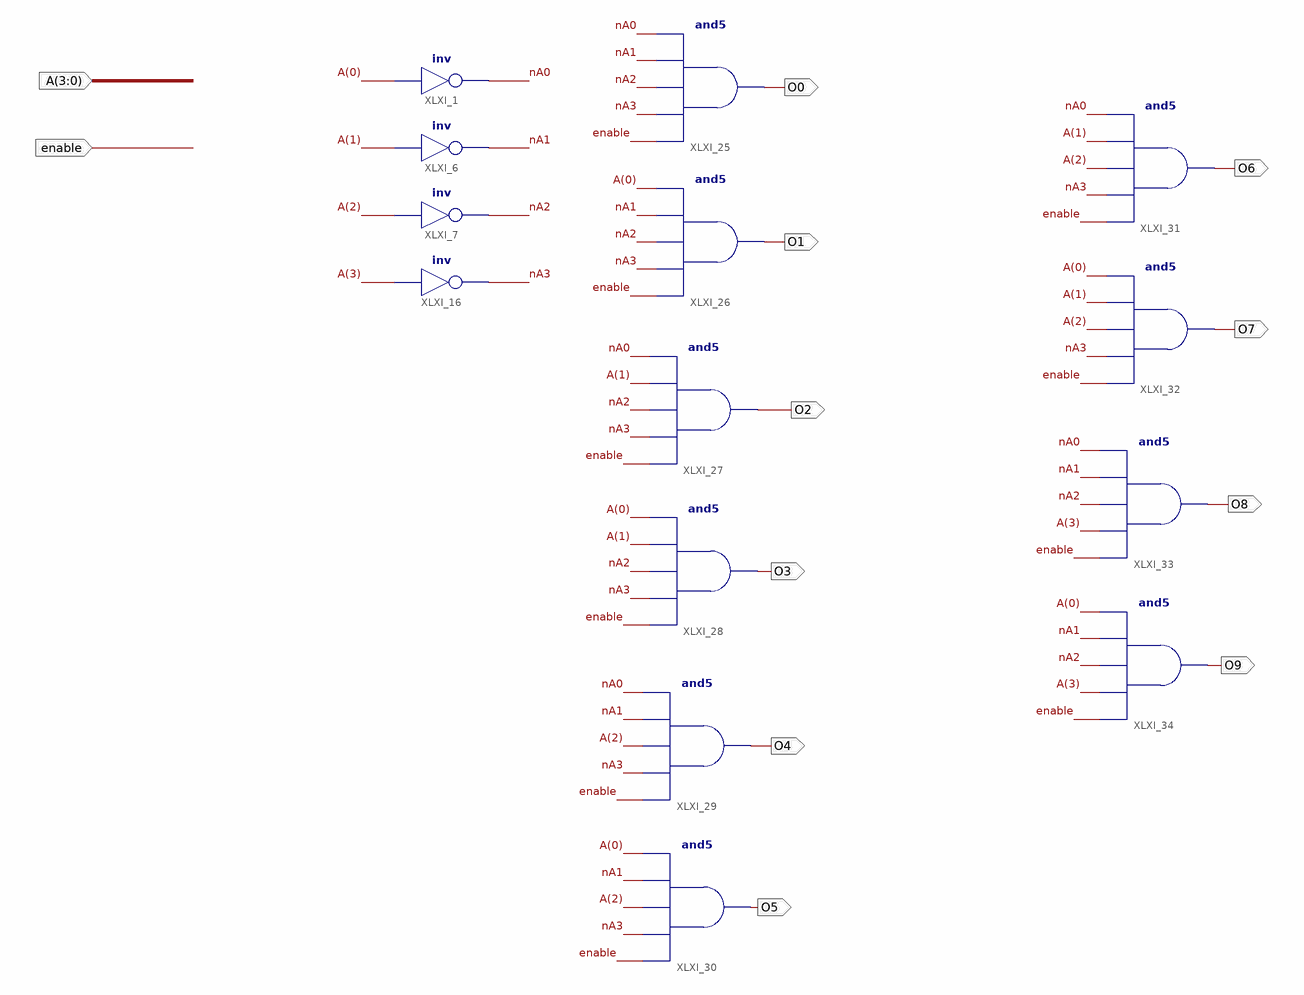
[diagram p0: schematic sheet 1]
// Xilinx ISE schematic RegisterFileV2Decoder.sch (spartan3e) as structural Verilog: 14 symbols, 12 ports
module RegisterFileV2Decoder (
  input  [3:0] A,
  input  enable,
  output O8,
  output O9,
  output O0,
  output O2,
  output O1,
  output O3,
  output O4,
  output O5,
  output O7,
  output O6
);

  wire nA0, nA1, nA2, nA3;

  not XLXI_1 (nA0, A[0]);
  not XLXI_6 (nA1, A[1]);
  not XLXI_7 (nA2, A[2]);
  not XLXI_16 (nA3, A[3]);
  and XLXI_31 (O6, enable, nA3, A[2], A[1], nA0);
  and XLXI_32 (O7, enable, nA3, A[2], A[1], A[0]);
  and XLXI_33 (O8, enable, A[3], nA2, nA1, nA0);
  and XLXI_34 (O9, enable, A[3], nA2, nA1, A[0]);
  and XLXI_25 (O0, enable, nA3, nA2, nA1, nA0);
  and XLXI_26 (O1, enable, nA3, nA2, nA1, A[0]);
  and XLXI_27 (O2, enable, nA3, nA2, A[1], nA0);
  and XLXI_28 (O3, enable, nA3, nA2, A[1], A[0]);
  and XLXI_29 (O4, enable, nA3, A[2], nA1, nA0);
  and XLXI_30 (O5, enable, nA3, A[2], nA1, A[0]);
endmodule
